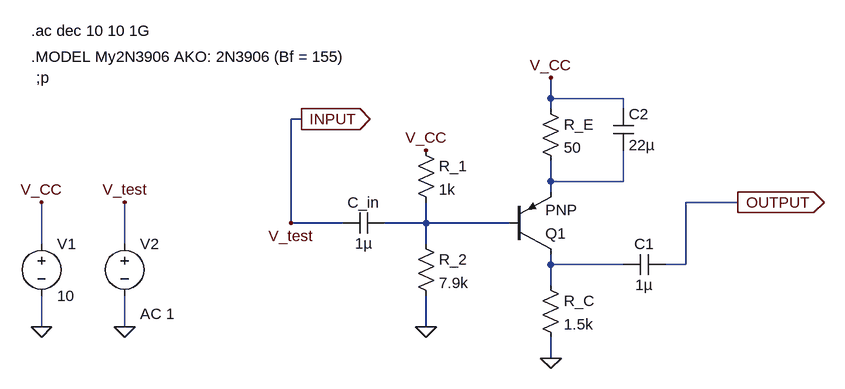
[diagram p0: schematic S2_PNP_CEdegen.asc]
S2_PNP_CEdegen.asc, the LTspice schematic file:
Version 4
SHEET 1 880 680
WIRE 240 0 240 -32
WIRE 352 0 240 0
WIRE 240 16 240 0
WIRE 352 16 352 0
WIRE -144 32 -160 32
WIRE 240 128 240 96
WIRE 352 128 352 80
WIRE 352 128 240 128
WIRE 240 144 240 128
WIRE 528 160 448 160
WIRE -160 192 -160 32
WIRE -80 192 -160 192
WIRE 48 192 48 160
WIRE 48 192 -16 192
WIRE 176 192 48 192
WIRE -544 224 -544 160
WIRE -416 224 -416 160
WIRE 48 224 48 192
WIRE 240 256 240 240
WIRE 352 256 240 256
WIRE 448 256 448 160
WIRE 448 256 416 256
WIRE 240 288 240 256
WIRE -544 352 -544 304
WIRE -416 352 -416 304
WIRE 48 352 48 304
WIRE 240 400 240 368
FLAG -416 352 0
FLAG -544 352 0
FLAG 48 352 0
FLAG -544 160 V_CC
FLAG -416 160 V_test
FLAG -144 32 INPUT
IOPIN -144 32 Out
FLAG 48 80 V_CC
FLAG -160 192 V_test
FLAG 240 400 0
FLAG 240 -32 V_CC
FLAG 528 160 OUTPUT
IOPIN 528 160 Out
SYMBOL res 32 64 R0
SYMATTR InstName R_1
SYMATTR Value 1k
SYMBOL res 32 208 R0
SYMATTR InstName R_2
SYMATTR Value 7.9k
SYMBOL cap -16 176 R90
WINDOW 0 0 32 VBottom 2
WINDOW 3 32 32 VTop 2
SYMATTR InstName C_in
SYMATTR Value 1µ
SYMBOL voltage -544 208 R0
WINDOW 123 0 0 Left 0
WINDOW 39 0 0 Left 0
SYMATTR InstName V1
SYMATTR Value 10
SYMBOL voltage -416 208 R0
WINDOW 123 24 124 Left 2
WINDOW 39 0 0 Left 0
SYMATTR Value2 AC 1
SYMATTR InstName V2
SYMATTR Value ""
SYMBOL pnp 176 240 M180
SYMATTR InstName Q1
SYMBOL res 224 0 R0
SYMATTR InstName R_E
SYMATTR Value 50
SYMBOL res 224 272 R0
SYMATTR InstName R_C
SYMATTR Value 1.5k
SYMBOL cap 416 240 R90
WINDOW 0 0 32 VBottom 2
WINDOW 3 32 32 VTop 2
SYMATTR InstName C1
SYMATTR Value 1µ
SYMBOL cap 336 16 R0
SYMATTR InstName C2
SYMATTR Value 22µ
TEXT -560 -64 Left 2 !.MODEL My2N3906 AKO: 2N3906 (Bf = 155)
TEXT -560 -104 Left 2 !.ac dec 10 10 1G
TEXT -552 -32 Left 2 !;p

The netlist it stands for:
* S2_PNP_CEdegen.asc
R_1 V_CC N002 1k
R_2 N002 0 7.9k
C_in N002 INPUT 1µ
V1 V_CC 0 10
V2 INPUT 0 AC 1
Q1 N003 N002 N001 0 PNP
R_E V_CC N001 50
R_C N003 0 1.5k
C1 OUTPUT N003 1µ
C2 V_CC N001 22µ
.model NPN NPN
.model PNP PNP
.lib standard.bjt
.MODEL My2N3906 AKO: 2N3906 (Bf = 155)
.ac dec 10 10 1G
;p
.backanno
.end